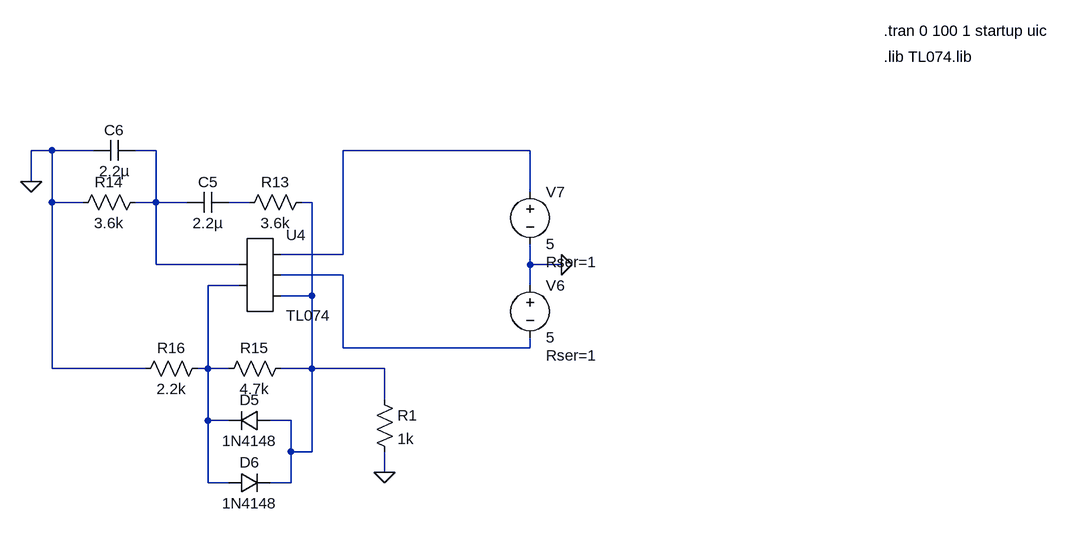
[diagram p0: schematic RingGen.asc]
RingGen.asc, the LTspice schematic file:
Version 4
SHEET 1 880 1040
WIRE -2752 -16 -2784 -16
WIRE -2688 -16 -2752 -16
WIRE -2592 -16 -2624 -16
WIRE -2016 -16 -2304 -16
WIRE -2784 32 -2784 -16
WIRE -2016 48 -2016 -16
WIRE -2752 64 -2752 -16
WIRE -2704 64 -2752 64
WIRE -2592 64 -2592 -16
WIRE -2592 64 -2624 64
WIRE -2544 64 -2592 64
WIRE -2448 64 -2480 64
WIRE -2352 64 -2368 64
WIRE -2304 144 -2304 -16
WIRE -2304 144 -2400 144
WIRE -2592 160 -2592 64
WIRE -2464 160 -2592 160
WIRE -2016 160 -2016 128
WIRE -1968 160 -2016 160
WIRE -2304 176 -2400 176
WIRE -2464 192 -2512 192
WIRE -2016 192 -2016 160
WIRE -2352 208 -2352 64
WIRE -2352 208 -2400 208
WIRE -2304 288 -2304 176
WIRE -2016 288 -2016 272
WIRE -2016 288 -2304 288
WIRE -2752 320 -2752 64
WIRE -2608 320 -2752 320
WIRE -2512 320 -2512 192
WIRE -2512 320 -2528 320
WIRE -2480 320 -2512 320
WIRE -2352 320 -2352 208
WIRE -2352 320 -2400 320
WIRE -2240 320 -2352 320
WIRE -2240 368 -2240 320
WIRE -2512 400 -2512 320
WIRE -2480 400 -2512 400
WIRE -2384 400 -2416 400
WIRE -2384 448 -2384 400
WIRE -2352 448 -2352 320
WIRE -2352 448 -2384 448
WIRE -2240 480 -2240 448
WIRE -2512 496 -2512 400
WIRE -2480 496 -2512 496
WIRE -2384 496 -2384 448
WIRE -2384 496 -2416 496
FLAG -1968 160 0
FLAG -2784 32 0
FLAG -2240 480 0
SYMBOL AutoGenerated\\TL074 -2432 176 R0
SYMATTR InstName U4
SYMATTR ModelFile C:\Users\Sam Bach\Desktop\Electronics\MiniPhoneSwitch\Spice\ToneGeneration\TL074.lib
SYMBOL voltage -2016 176 R0
WINDOW 123 0 0 Left 0
WINDOW 39 24 124 Left 2
SYMATTR SpiceLine Rser=1
SYMATTR InstName V6
SYMATTR Value 5
SYMBOL voltage -2016 32 R0
WINDOW 123 0 0 Left 0
WINDOW 39 24 124 Left 2
SYMATTR SpiceLine Rser=1
SYMATTR InstName V7
SYMATTR Value 5
SYMBOL res -2352 48 R90
WINDOW 0 0 56 VBottom 2
WINDOW 3 32 56 VTop 2
SYMATTR InstName R13
SYMATTR Value 3.6k
SYMBOL cap -2480 48 R90
WINDOW 0 0 32 VBottom 2
WINDOW 3 32 32 VTop 2
SYMATTR InstName C5
SYMATTR Value 2.2µ
SYMBOL res -2608 48 R90
WINDOW 0 0 56 VBottom 2
WINDOW 3 32 56 VTop 2
SYMATTR InstName R14
SYMATTR Value 3.6k
SYMBOL cap -2624 -32 R90
WINDOW 0 0 32 VBottom 2
WINDOW 3 32 32 VTop 2
SYMATTR InstName C6
SYMATTR Value 2.2µ
SYMBOL res -2384 304 R90
WINDOW 0 0 56 VBottom 2
WINDOW 3 32 56 VTop 2
SYMATTR InstName R15
SYMATTR Value 4.7k
SYMBOL res -2512 304 R90
WINDOW 0 0 56 VBottom 2
WINDOW 3 32 56 VTop 2
SYMATTR InstName R16
SYMATTR Value 2.2k
SYMBOL diode -2416 384 R90
WINDOW 0 0 32 VBottom 2
WINDOW 3 32 32 VTop 2
SYMATTR InstName D5
SYMATTR Value 1N4148
SYMBOL diode -2480 512 R270
WINDOW 0 32 32 VTop 2
WINDOW 3 0 32 VBottom 2
SYMATTR InstName D6
SYMATTR Value 1N4148
SYMBOL res -2256 352 R0
SYMATTR InstName R1
SYMATTR Value 1k
TEXT -1472 -160 Left 2 !.lib TL074.lib
TEXT -1472 -200 Left 2 !.tran 0 100 1 startup uic

The netlist it stands for:
* RingGen.asc
* U4: TL074 (symbol AutoGenerated\TL074 not available, pins judged from their places): pin1=N001 pin2=N006 pin3=N002 pin4=N005 pin5=N004
V6 0 N005 5 Rser=1
V7 N002 0 5 Rser=1
R13 N004 N003 3.6k
C5 N003 N001 2.2µ
R14 N001 0 3.6k
C6 N001 0 2.2µ
R15 N004 N006 4.7k
R16 N006 0 2.2k
D5 N004 N006 1N4148
D6 N006 N004 1N4148
R1 N004 0 1k
.model D D
.lib standard.dio
.lib TL074.lib
.tran 0 100 1 startup uic
.lib C:\Users\Sam Bach\Desktop\Electronics\MiniPhoneSwitch\Spice\ToneGeneration\TL074.lib
.backanno
.end